# Altium schematic sheet Sensor.SchDoc
size A4
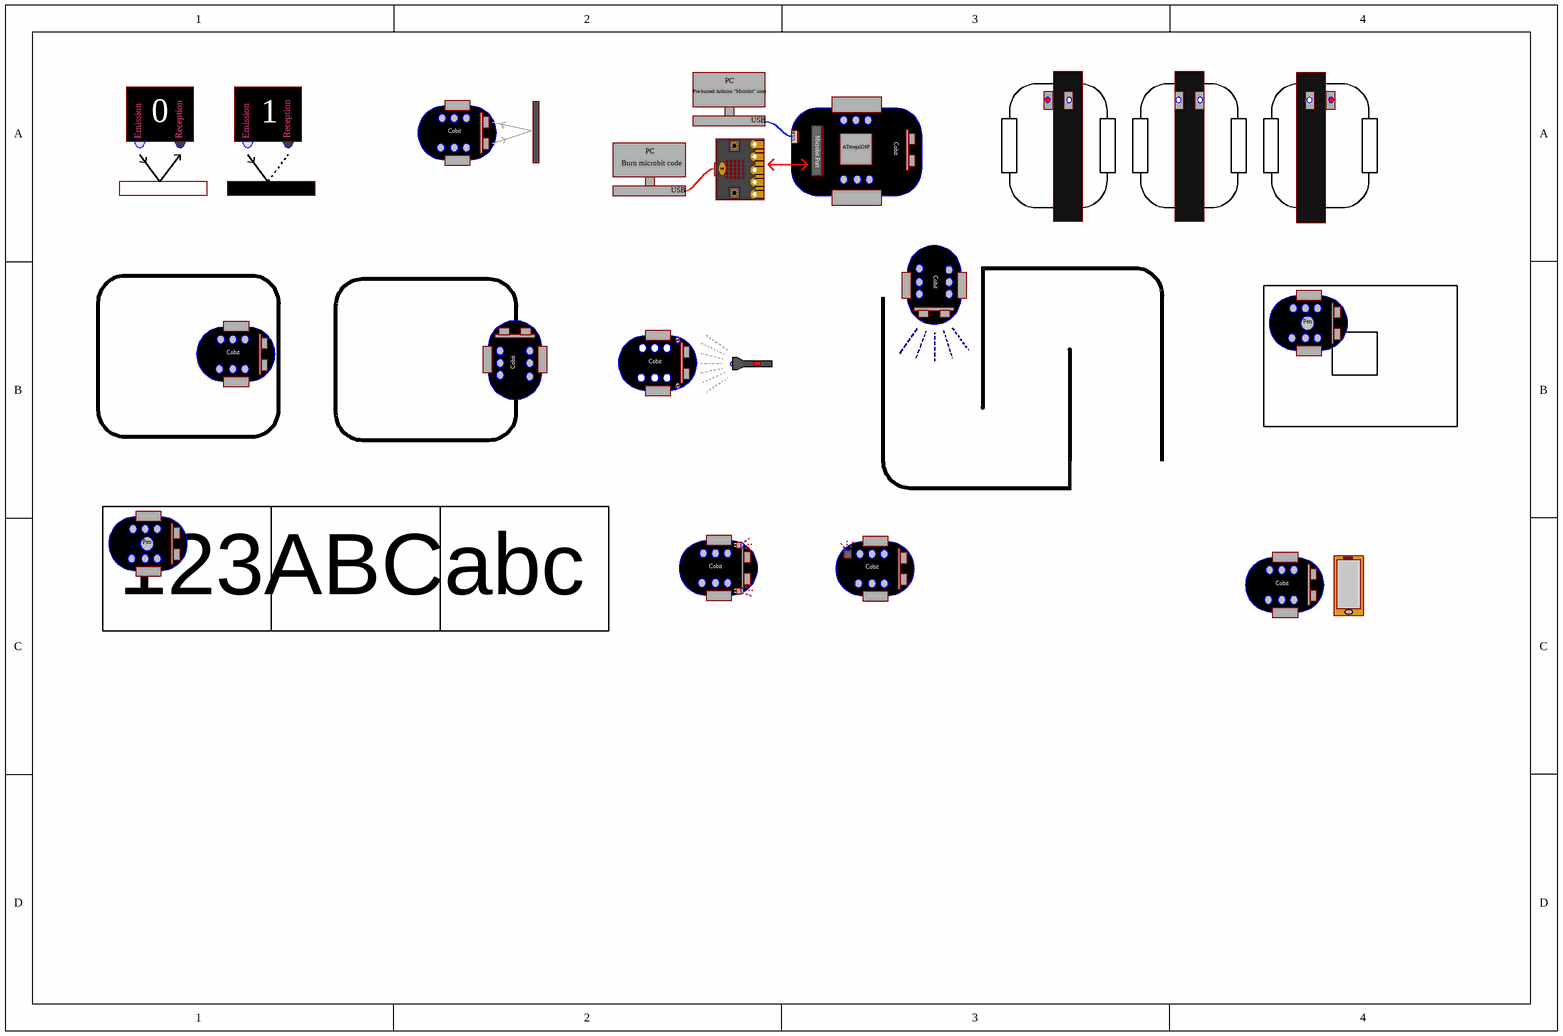
[diagram p0: Sensor.SchDoc]

## Notes on the sheet
- Pre-burned Arduino "Microbit" code
- PC
- Emission
- 0
- Reception
- 1
- Cobit
- Burn microbit code
- USB
- Microbit Port
- ATmega328P
- Pen
- 123ABCabc